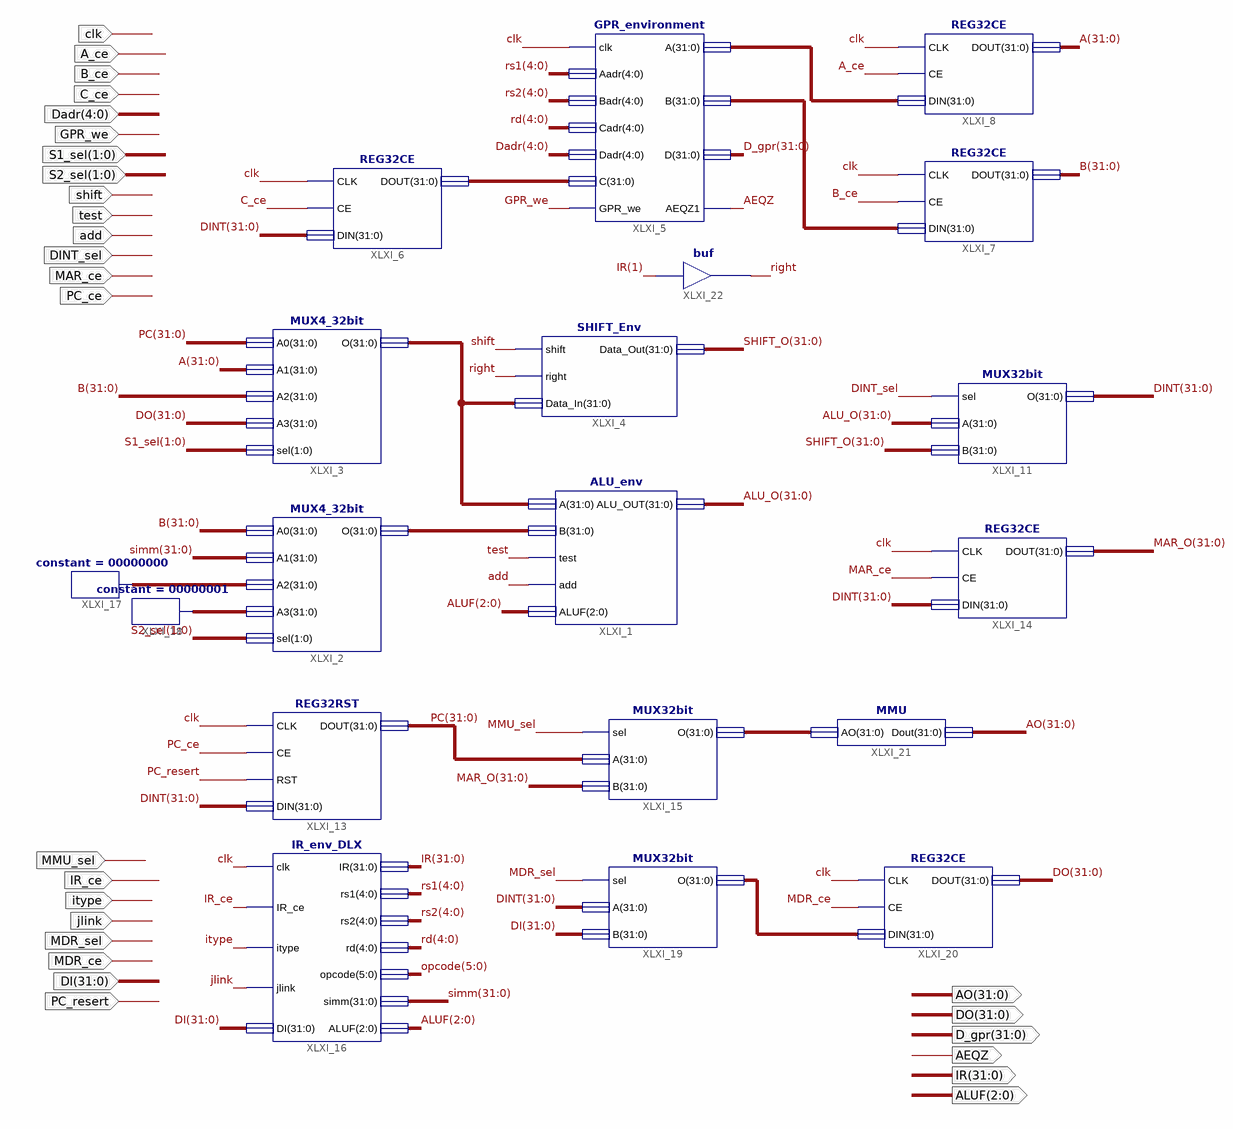
[diagram p0: schematic sheet 1]
// Xilinx ISE schematic DLX_Data_Path.sch (spartan6) as structural Verilog: 19 symbols, 28 ports
module DLX_Data_Path (
  input  C_ce,
  input  A_ce,
  input  B_ce,
  input  clk,
  input  DINT_sel,
  input  PC_ce,
  input  PC_resert,
  input  MAR_ce,
  input  MMU_sel,
  input  MDR_sel,
  input  MDR_ce,
  input  [31:0] DI,
  input  shift,
  input  test,
  input  add,
  input  [4:0] Dadr,
  input  GPR_we,
  input  IR_ce,
  input  itype,
  input  jlink,
  input  [1:0] S2_sel,
  input  [1:0] S1_sel,
  output [31:0] AO,
  output [31:0] DO,
  output [31:0] D_gpr,
  output AEQZ,
  output [2:0] ALUF,
  output [31:0] IR
);

  wire right;
  wire [4:0] rd, rs1, rs2;
  wire [5:0] opcode;
  wire [31:0] A, ALU_O, B, const_0, const_1, DINT, MAR_O, PC, SHIFT_O, simm, XLXN_10, XLXN_11, XLXN_12,
       XLXN_33, XLXN_34, XLXN_66, XLXN_166;

  ALU_env XLXI_1 (.A(XLXN_33), .B(XLXN_34), .test(test), .add(add), .ALUF(ALUF), .ALU_OUT(ALU_O));
  MUX4_32bit XLXI_2 (.A0(B), .A1(simm), .A2(const_0), .A3(const_1), .sel(S2_sel), .O(XLXN_34));
  MUX4_32bit XLXI_3 (.A0(PC), .A1(A), .A2(B), .A3(DO), .sel(S1_sel), .O(XLXN_33));
  SHIFT_Env XLXI_4 (.shift(shift), .right(right), .Data_In(XLXN_33), .Data_Out(SHIFT_O));
  GPR_environment XLXI_5 (
    .clk(clk), .Aadr(rs1), .Badr(rs2), .Cadr(rd), .Dadr(Dadr), .C(XLXN_10), .GPR_we(GPR_we), .A(XLXN_11),
    .B(XLXN_12), .D(D_gpr), .AEQZ1(AEQZ));
  REG32CE XLXI_7 (.CLK(clk), .CE(B_ce), .DIN(XLXN_12), .DOUT(B));
  REG32CE XLXI_8 (.CLK(clk), .CE(A_ce), .DIN(XLXN_11), .DOUT(A));
  REG32CE XLXI_6 (.CLK(clk), .CE(C_ce), .DIN(DINT), .DOUT(XLXN_10));
  MUX32bit XLXI_11 (.sel(DINT_sel), .A(ALU_O), .B(SHIFT_O), .O(DINT));
  REG32RST XLXI_13 (.CLK(clk), .CE(PC_ce), .RST(PC_resert), .DIN(DINT), .DOUT(PC));
  REG32CE XLXI_14 (.CLK(clk), .CE(MAR_ce), .DIN(DINT), .DOUT(MAR_O));
  MUX32bit XLXI_15 (.sel(MMU_sel), .A(PC), .B(MAR_O), .O(XLXN_166));
  IR_env_DLX XLXI_16 (
    .clk(clk), .IR_ce(IR_ce), .itype(itype), .jlink(jlink), .DI(DI), .IR(IR), .rs1(rs1), .rs2(rs2), .rd(rd),
    .opcode(opcode), .simm(simm), .ALUF(ALUF));
  constant #(.CValue("00000000")) XLXI_17 (.O(const_0));
  constant #(.CValue("00000001")) XLXI_18 (.O(const_1));
  MUX32bit XLXI_19 (.sel(MDR_sel), .A(DINT), .B(DI), .O(XLXN_66));
  REG32CE XLXI_20 (.CLK(clk), .CE(MDR_ce), .DIN(XLXN_66), .DOUT(DO));
  MMU XLXI_21 (.AO(XLXN_166), .Dout(AO));
  buf XLXI_22 (right, IR[1]);
endmodule
